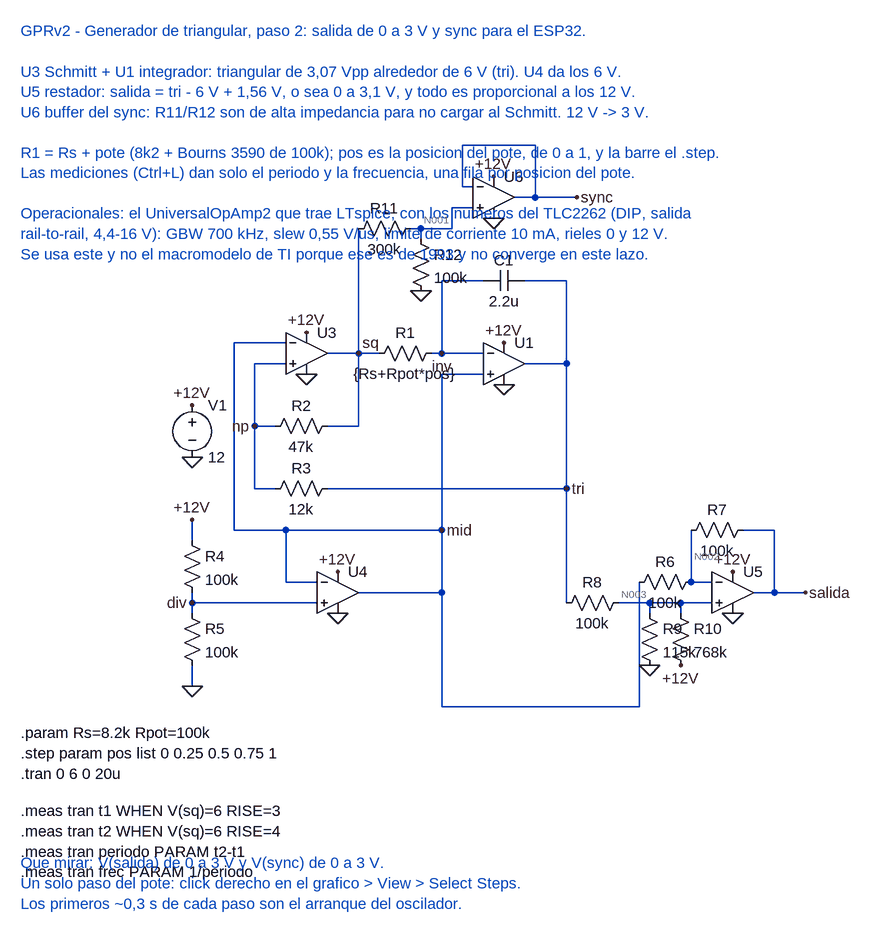
[diagram p0: schematic triangular2.asc]
triangular2.asc, the LTspice schematic file:
Version 4.1
SHEET 1 1800 1400
WIRE 352 -224 464 -224
WIRE 352 -160 352 -224
WIRE 368 -160 352 -160
WIRE 464 -144 464 -224
WIRE 464 -144 432 -144
WIRE 528 -144 464 -144
WIRE 336 -128 368 -128
WIRE 192 -96 192 96
WIRE 272 -96 288 -96
WIRE 288 -96 336 -96
WIRE 336 -96 336 -128
WIRE 288 -80 288 -96
WIRE 384 -16 320 -16
WIRE 512 -16 448 -16
WIRE 80 80 0 80
WIRE 192 96 144 96
WIRE 224 96 192 96
WIRE 320 96 320 -16
WIRE 320 96 304 96
WIRE 384 96 320 96
WIRE 80 112 32 112
WIRE 512 112 512 -16
WIRE 512 112 448 112
WIRE 384 128 320 128
WIRE 32 208 32 112
WIRE 64 208 32 208
WIRE 192 208 192 96
WIRE 192 208 144 208
WIRE 32 304 32 208
WIRE 64 304 32 304
WIRE 512 304 512 112
WIRE 512 304 144 304
WIRE 0 368 0 80
WIRE 80 368 0 368
WIRE 320 368 320 128
WIRE 320 368 80 368
WIRE 704 368 704 448
WIRE 784 368 832 368
WIRE -64 384 -64 352
WIRE 704 448 736 448
WIRE 80 448 80 368
WIRE 128 448 80 448
WIRE 320 464 320 368
WIRE 320 464 192 464
WIRE 832 464 832 368
WIRE 832 464 800 464
WIRE 880 464 832 464
WIRE 512 480 512 304
WIRE 592 480 640 480
WIRE 640 480 688 480
WIRE 688 480 736 480
WIRE -64 480 -64 464
WIRE 128 480 -64 480
WIRE 640 496 640 480
WIRE 688 496 688 480
WIRE -64 496 -64 480
WIRE -64 608 -64 576
WIRE 320 640 320 464
WIRE 624 640 320 640
WIRE 624 448 624 640
FLAG -64 256 0
FLAG -64 176 +12V
FLAG -64 608 0
FLAG 160 496 0
FLAG 112 128 0
FLAG 416 144 0
FLAG 112 64 +12V
FLAG 416 80 +12V
FLAG 160 432 +12V
FLAG -64 352 +12V
FLAG 192 96 sq
FLAG 32 208 np
FLAG 320 96 inv
FLAG 512 304 tri
FLAG 320 368 mid
FLAG -64 480 div
FLAG 288 0 0
FLAG 400 -176 +12V
FLAG 400 -112 0
FLAG 528 -144 sync
FLAG 640 576 0
FLAG 688 576 +12V
FLAG 768 432 +12V
FLAG 768 496 0
FLAG 880 464 salida
SYMBOL res 320 80 R90
WINDOW 0 0 56 VBottom 2
WINDOW 3 32 56 VTop 2
SYMATTR InstName R1
SYMATTR Value {Rs+Rpot*pos}
SYMBOL cap 448 -32 R90
WINDOW 0 0 32 VBottom 2
WINDOW 3 32 32 VTop 2
SYMATTR InstName C1
SYMATTR Value 2.2u
SYMBOL res 160 192 R90
WINDOW 0 0 56 VBottom 2
WINDOW 3 32 56 VTop 2
SYMATTR InstName R2
SYMATTR Value 47k
SYMBOL res 160 288 R90
WINDOW 0 0 56 VBottom 2
WINDOW 3 32 56 VTop 2
SYMATTR InstName R3
SYMATTR Value 12k
SYMBOL voltage -64 160 R0
WINDOW 123 0 0 Left 0
WINDOW 39 0 0 Left 0
SYMATTR InstName V1
SYMATTR Value 12
SYMBOL res -80 368 R0
SYMATTR InstName R4
SYMATTR Value 100k
SYMBOL res -80 480 R0
SYMATTR InstName R5
SYMATTR Value 100k
SYMBOL OpAmps\\UniversalOpAmp2 416 112 R0
SYMATTR InstName U1
SYMATTR Value2 Avol=1Meg GBW=700k Slew=0.55Meg
SYMATTR SpiceLine Ilimit=10m Rail=0 Vos=0
SYMBOL OpAmps\\UniversalOpAmp2 112 96 R0
SYMATTR InstName U3
SYMATTR Value2 Avol=1Meg GBW=700k Slew=0.55Meg
SYMATTR SpiceLine Ilimit=10m Rail=0 Vos=0
SYMBOL OpAmps\\UniversalOpAmp2 160 464 R0
SYMATTR InstName U4
SYMATTR Value2 Avol=1Meg GBW=700k Slew=0.55Meg
SYMATTR SpiceLine Ilimit=10m Rail=0 Vos=0
SYMBOL res 288 -112 R90
WINDOW 0 0 56 VBottom 2
WINDOW 3 32 56 VTop 2
SYMATTR InstName R11
SYMATTR Value 300k
SYMBOL res 272 -96 R0
SYMATTR InstName R12
SYMATTR Value 100k
SYMBOL OpAmps\\UniversalOpAmp2 400 -144 R0
SYMATTR InstName U6
SYMATTR Value2 Avol=1Meg GBW=700k Slew=0.55Meg
SYMATTR SpiceLine Ilimit=10m Rail=0 Vos=0
SYMBOL res 608 464 R90
WINDOW 0 0 56 VBottom 2
WINDOW 3 32 56 VTop 2
SYMATTR InstName R8
SYMATTR Value 100k
SYMBOL res 624 480 R0
SYMATTR InstName R9
SYMATTR Value 115k
SYMBOL res 672 480 R0
SYMATTR InstName R10
SYMATTR Value 768k
SYMBOL res 720 432 R90
WINDOW 0 0 56 VBottom 2
WINDOW 3 32 56 VTop 2
SYMATTR InstName R6
SYMATTR Value 100k
SYMBOL res 800 352 R90
WINDOW 0 0 56 VBottom 2
WINDOW 3 32 56 VTop 2
SYMATTR InstName R7
SYMATTR Value 100k
SYMBOL OpAmps\\UniversalOpAmp2 768 464 R0
SYMATTR InstName U5
SYMATTR Value2 Avol=1Meg GBW=700k Slew=0.55Meg
SYMATTR SpiceLine Ilimit=10m Rail=0 Vos=0
TEXT -328 -400 Left 2 ;GPRv2 - Generador de triangular, paso 2: salida de 0 a 3 V y sync para el ESP32.\n\nU3 Schmitt + U1 integrador: triangular de 3,07 Vpp alrededor de 6 V (tri). U4 da los 6 V.\nU5 restador: salida = tri - 6 V + 1,56 V, o sea 0 a 3,1 V, y todo es proporcional a los 12 V.\nU6 buffer del sync: R11/R12 son de alta impedancia para no cargar al Schmitt. 12 V -> 3 V.\n\nR1 = Rs + pote (8k2 + Bourns 3590 de 100k); pos es la posicion del pote, de 0 a 1, y la barre el .step.\nLas mediciones (Ctrl+L) dan solo el periodo y la frecuencia, una fila por posicion del pote.\n\nOperacionales: el UniversalOpAmp2 que trae LTspice, con los numeros del TLC2262 (DIP, salida\nrail-to-rail, 4,4-16 V): GBW 700 kHz, slew 0,55 V/us, limite de corriente 10 mA, rieles 0 y 12 V.\nSe usa este y no el macromodelo de TI porque ese es de 1993 y no converge en este lazo.
TEXT -328 680 Left 2 !.param Rs=8.2k Rpot=100k\n.step param pos list 0 0.25 0.5 0.75 1\n.tran 0 6 0 20u
TEXT -328 800 Left 2 !.meas tran t1 WHEN V(sq)=6 RISE=3\n.meas tran t2 WHEN V(sq)=6 RISE=4\n.meas tran periodo PARAM t2-t1\n.meas tran frec PARAM 1/periodo
TEXT -328 880 Left 2 ;Que mirar: V(salida) de 0 a 3 V y V(sync) de 0 a 3 V.\nUn solo paso del pote: click derecho en el grafico > View > Select Steps.\nLos primeros ~0,3 s de cada paso son el arranque del oscilador.

The netlist it stands for:
* triangular2.asc
R1 inv sq {Rs+Rpot*pos}
C1 tri inv 2.2u
R2 sq np 47k
R3 tri np 12k
V1 +12V 0 12
R4 +12V div 100k
R5 div 0 100k
X§U1 mid inv +12V 0 tri level2 Avol=1Meg GBW=700k Slew=0.55Meg Ilimit=10m Rail=0 Vos=0 En=0 Enk=0 In=0 Ink=0 Rin=500Meg  ; pins In+ In- V+ V- OUT
X§U3 np mid +12V 0 sq level2 Avol=1Meg GBW=700k Slew=0.55Meg Ilimit=10m Rail=0 Vos=0 En=0 Enk=0 In=0 Ink=0 Rin=500Meg  ; pins In+ In- V+ V- OUT
X§U4 div mid +12V 0 mid level2 Avol=1Meg GBW=700k Slew=0.55Meg Ilimit=10m Rail=0 Vos=0 En=0 Enk=0 In=0 Ink=0 Rin=500Meg  ; pins In+ In- V+ V- OUT
R11 N001 sq 300k
R12 N001 0 100k
X§U6 N001 sync +12V 0 sync level2 Avol=1Meg GBW=700k Slew=0.55Meg Ilimit=10m Rail=0 Vos=0 En=0 Enk=0 In=0 Ink=0 Rin=500Meg  ; pins In+ In- V+ V- OUT
R8 N003 tri 100k
R9 N003 0 115k
R10 N003 +12V 768k
R6 N002 mid 100k
R7 salida N002 100k
X§U5 N003 N002 +12V 0 salida level2 Avol=1Meg GBW=700k Slew=0.55Meg Ilimit=10m Rail=0 Vos=0 En=0 Enk=0 In=0 Ink=0 Rin=500Meg  ; pins In+ In- V+ V- OUT
* GPRv2 - Generador de triangular, paso 2: salida de 0 a 3 V y sync para el ESP32.
* U3 Schmitt + U1 integrador: triangular de 3,07 Vpp alrededor de 6 V (tri). U4 da los 6 V.
* U5 restador: salida = tri - 6 V + 1,56 V, o sea 0 a 3,1 V, y todo es proporcional a los 12 V.
* U6 buffer del sync: R11/R12 son de alta impedancia para no cargar al Schmitt. 12 V -> 3 V.
* R1 = Rs + pote (8k2 + Bourns 3590 de 100k); pos es la posicion del pote, de 0 a 1, y la barre el .step.
* Las mediciones (Ctrl+L) dan solo el periodo y la frecuencia, una fila por posicion del pote.
* Operacionales: el UniversalOpAmp2 que trae LTspice, con los numeros del TLC2262 (DIP, salida
* rail-to-rail, 4,4-16 V): GBW 700 kHz, slew 0,55 V/us, limite de corriente 10 mA, rieles 0 y 12 V.
* Se usa este y no el macromodelo de TI porque ese es de 1993 y no converge en este lazo.
.param Rs=8.2k Rpot=100k
.step param pos list 0 0.25 0.5 0.75 1
.tran 0 6 0 20u
.meas tran t1 WHEN V(sq)=6 RISE=3
.meas tran t2 WHEN V(sq)=6 RISE=4
.meas tran periodo PARAM t2-t1
.meas tran frec PARAM 1/periodo
* Que mirar: V(salida) de 0 a 3 V y V(sync) de 0 a 3 V.
* Un solo paso del pote: click derecho en el grafico > View > Select Steps.
* Los primeros ~0,3 s de cada paso son el arranque del oscilador.
.lib UniversalOpAmp2.lib
.backanno
.end

* Results of the author's LTspice run, read from the files saved beside the schematic
* Operating Point (first step), zero values left out:
*   V(sq) = 6 V
*   V(np) = 6 V
*   V(+12v) = 12 V
*   V(mid) = 6 V
*   V(n003) = 3.782 V
*   V(salida) = 1.563 V
*   V(inv) = 6 V
*   V(tri) = 6 V
*   V(div) = 6 V
*   V(n001) = 1.501 V
*   V(sync) = 1.501 V
*   V(n002) = 3.782 V
*   I(V1) = -2.688 mA
*   I(R4) = 60 µA
*   I(R11) = -15 µA
*   I(R9) = 32.89 µA
*   I(R6) = -22.18 µA
*   I(R7) = -22.19 µA
*   I(R5) = 60 µA
*   I(R12) = 15.01 µA
*   I(R8) = -22.18 µA
*   I(R10) = -10.7 µA
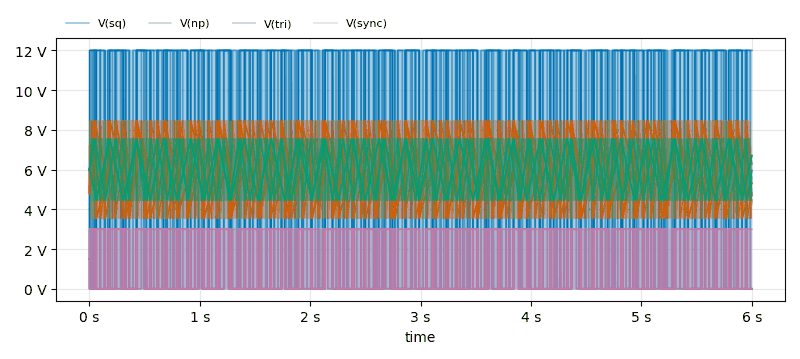
[diagram p1: Transient Analysis of triangular2.asc, plotted from the saved traces]
* Transient Analysis, 5 runs:
*   V(sq) [run 1]: min 8.35 mV, max 11.99 V, average 5.996 V, rms 8.472 V, last 8.903 mV
*   V(sq) [run 2]: min 2.658 mV, max 12 V, average 6.005 V, rms 8.485 V, last 2.858 mV
*   V(sq) [run 3]: min 1.857 mV, max 12 V, average 6.025 V, rms 8.501 V, last 12 V
*   V(sq) [run 4]: min 1.537 mV, max 12 V, average 6.001 V, rms 8.484 V, last 1.798 mV
*   V(sq) [run 5]: min 1.366 mV, max 12 V, average 5.972 V, rms 8.463 V, last 1.757 mV
*   V(np) [run 1]: min 3.546 V, max 8.454 V, average 6 V, rms 6.165 V, last 5.883 V
*   V(np) [run 2]: min 3.554 V, max 8.446 V, average 6.001 V, rms 6.166 V, last 4.476 V
*   V(np) [run 3]: min 3.556 V, max 8.444 V, average 6.01 V, rms 6.174 V, last 6.272 V
*   V(np) [run 4]: min 3.557 V, max 8.443 V, average 6 V, rms 6.165 V, last 4.746 V
*   V(np) [run 5]: min 3.557 V, max 8.443 V, average 5.983 V, rms 6.148 V, last 5.342 V
*   V(tri) [run 1]: min 4.446 V, max 7.554 V, average 6.001 V, rms 6.069 V, last 7.382 V
*   V(tri) [run 2]: min 4.46 V, max 7.54 V, average 6 V, rms 6.068 V, last 5.617 V
*   V(tri) [run 3]: min 4.463 V, max 7.537 V, average 6.006 V, rms 6.073 V, last 4.81 V
*   V(tri) [run 4]: min 4.464 V, max 7.536 V, average 6 V, rms 6.067 V, last 5.957 V
*   V(tri) [run 5]: min 4.465 V, max 7.535 V, average 5.986 V, rms 6.053 V, last 6.706 V
*   V(sync) [run 1]: min 3.005 mV, max 2.998 V, average 1.5 V, rms 2.118 V, last 3.143 mV
*   V(sync) [run 2]: min 1.586 mV, max 3.004 V, average 1.502 V, rms 2.122 V, last 1.636 mV
*   V(sync) [run 3]: min 1.387 mV, max 3.001 V, average 1.507 V, rms 2.125 V, last 3 V
*   V(sync) [run 4]: min 1.308 mV, max 3.004 V, average 1.501 V, rms 2.121 V, last 1.373 mV
*   V(sync) [run 5]: min 1.265 mV, max 3.006 V, average 1.494 V, rms 2.116 V, last 1.362 mV